# Altium schematic sheet [02] - STM32F1.SchDoc
size A3; DocumentNumber: 4; SheetNumber: 4; SheetTotal: 5
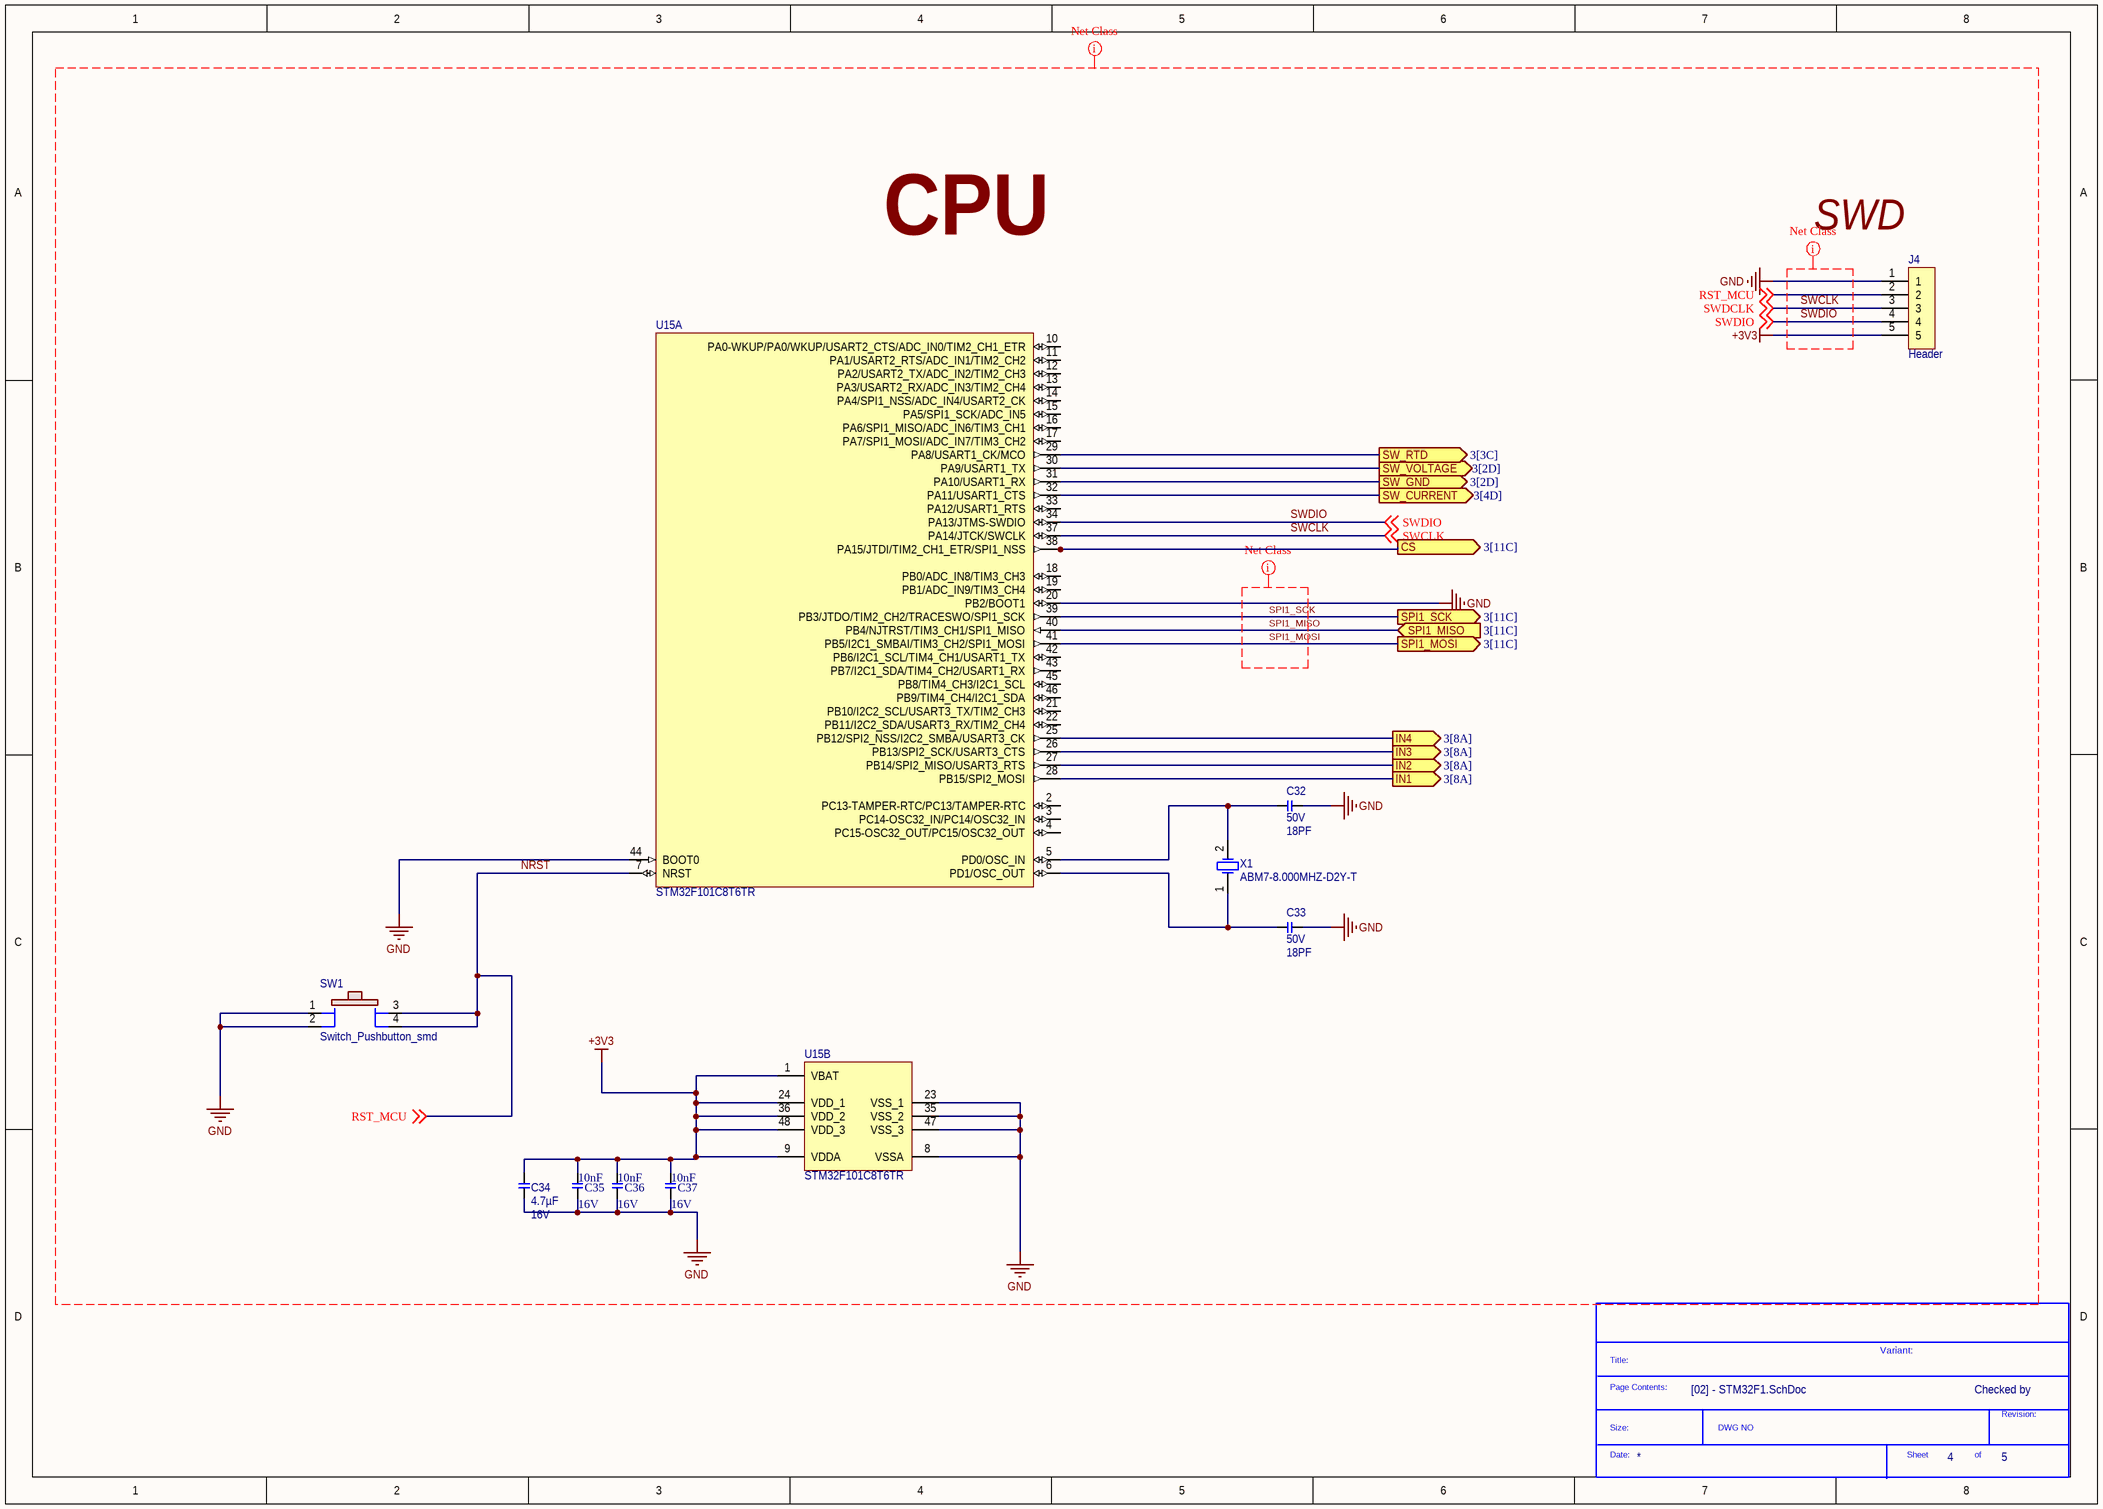
[diagram p0: [02] - STM32F1.SchDoc]

## Parts
*?  SDTitleBlock  (value not drawn)  (graphical)
C32  voltage_rating_dc: 50V  [C0805]  (hidden comment: 18PF)
C33  voltage_rating_dc: 50V  [C0805]  (hidden comment: 18PF)
C34  Voltage - Rated: 16V  [C0805]  (hidden comment: 4.7µF)
C35  Voltage - Rated: 16V  [C0805]  (hidden comment: 10nF)
C36  Voltage - Rated: 16V  [C0805]  (hidden comment: 10nF)
C37  Voltage - Rated: 16V  [C0805]  (hidden comment: 10nF)
J4  Header  [Header 1x5 2.54mm]  (no BOM)
SW1  Switch_Pushbutton_smd  [SW_B3SL-1022P]
U15  Manufacturer Part Number: STM32F101C8T6TR  [STM-LQFP48_M]  (hidden comment: IC-MC-STM32F101C8T6TR)  (parts A,B of 2)
X1  Manufacturer Part Number: ABM7-8.000MHZ-D2Y-T  [sm_osc_mixed]  (hidden comment: ABM7-8.000MHZ)

## Ports
CS (out, see 3[11C]), IN1 (out, see 3[8A]), IN2 (out, see 3[8A]), IN3 (out, see 3[8A]), IN4 (out, see 3[8A]), SPI1_MISO (in, see 3[11C]), SPI1_MOSI (out, see 3[11C]), SPI1_SCK (out, see 3[11C]), SW_CURRENT (out, see 3[4D]), SW_GND (out, see 3[2D]), SW_RTD (out, see 3[3C]), SW_VOLTAGE (out, see 3[2D])

## Nets
+3V3: C34.2 C35.2 C36.2 C37.2 J4.5 U15.1(VBAT) U15.9(VDDA) U15.24(VDD_1) U15.36(VDD_2) U15.48(VDD_3)
GND: C32.2 C33.2 C34.1 C35.1 C36.1 C37.1 J4.1 SW1.1 SW1.2 U15.8(VSSA) U15.20(PB2/BOOT1) U15.23(VSS_1) U15.35(VSS_2) U15.44(BOOT0) U15.47(VSS_3)
CS: U15.38(PA15/JTDI/TIM2_CH1_ETR/SPI1_NSS) ; port CS
IN1: U15.28(PB15/SPI2_MOSI) ; port IN1
IN2: U15.27(PB14/SPI2_MISO/USART3_RTS) ; port IN2
IN3: U15.26(PB13/SPI2_SCK/USART3_CTS) ; port IN3
IN4: U15.25(PB12/SPI2_NSS/I2C2_SMBA/USART3_CK) ; port IN4
NRST: J4.2 SW1.3 SW1.4 U15.7(NRST) ; off-sheet RST_MCU  [also labelled RST_MCU]
SPI1_MISO: U15.40(PB4/NJTRST/TIM3_CH1/SPI1_MISO) ; port SPI1_MISO
SPI1_MOSI: U15.41(PB5/I2C1_SMBAI/TIM3_CH2/SPI1_MOSI) ; port SPI1_MOSI
SPI1_SCK: U15.39(PB3/JTDO/TIM2_CH2/TRACESWO/SPI1_SCK) ; port SPI1_SCK
SW_CURRENT: U15.32(PA11/USART1_CTS) ; port SW_CURRENT
SW_GND: U15.31(PA10/USART1_RX) ; port SW_GND
SW_RTD: U15.29(PA8/USART1_CK/MCO) ; port SW_RTD
SW_VOLTAGE: U15.30(PA9/USART1_TX) ; port SW_VOLTAGE
SWCLK: J4.3 U15.37(PA14/JTCK/SWCLK) ; off-sheet SWCLK, off-sheet SWDCLK  [also labelled SWDCLK]
SWDIO: J4.4 U15.34(PA13/JTMS-SWDIO) ; off-sheet SWDIO
NetC32_1: C32.1 U15.5(PD0/OSC_IN) X1.2(OSC2)
NetC33_1: C33.1 U15.6(PD1/OSC_OUT) X1.1(OSC1)

Not connected (* = marked no-connect by the designer): U15 2(PC13-TAMPER-RTC/PC13/TAMPER-RTC) 3(PC14-OSC32_IN/PC14/OSC32_IN) 4(PC15-OSC32_OUT/PC15/OSC32_OUT) 10(PA0-WKUP/PA0/WKUP/USART2_CTS/ADC_IN0/TIM2_CH1_ETR) 11(PA1/USART2_RTS/ADC_IN1/TIM2_CH2) 12(PA2/USART2_TX/ADC_IN2/TIM2_CH3) 13(PA3/USART2_RX/ADC_IN3/TIM2_CH4) 14(PA4/SPI1_NSS/ADC_IN4/USART2_CK) 15(PA5/SPI1_SCK/ADC_IN5) 16(PA6/SPI1_MISO/ADC_IN6/TIM3_CH1) 17(PA7/SPI1_MOSI/ADC_IN7/TIM3_CH2) 18(PB0/ADC_IN8/TIM3_CH3) 19(PB1/ADC_IN9/TIM3_CH4) 21(PB10/I2C2_SCL/USART3_TX/TIM2_CH3) 22(PB11/I2C2_SDA/USART3_RX/TIM2_CH4) 33(PA12/USART1_RTS) 42(PB6/I2C1_SCL/TIM4_CH1/USART1_TX) 43(PB7/I2C1_SDA/TIM4_CH2/USART1_RX) 45(PB8/TIM4_CH3/I2C1_SCL) 46(PB9/TIM4_CH4/I2C1_SDA)

## Layout directives
net class SPI_1: SPI1_MISO, SPI1_MOSI, SPI1_SCK
net class SWD: SWCLK, SWDIO
net class CPU: +3V3, GND, NRST, RST_MCU, SPI1_MISO, SPI1_MOSI, SPI1_SCK, SWCLK, SWDCLK, SWDIO

## Notes on the sheet
- (near J4) SWD
- CPU
- Variant:
- Checked by
- (in symbol SDTitleBlock) Title:; Page Contents:; Revision:; Size:; DWG NO; Date:; Sheet; of

## Library data of the parts
C32 C33 = C-18PF,50V,0805: MULTICOMP - MC0805N180J500CT - CAP, MLCC, C0G/NP0, 18PF, 50V,0805, REEL; capacitance_tolerance: ±5%; pin_count: 2; Supplier 1: Octopart; Manufacturer: Multicomp; Manufacturer Part Number: MC0805N180J500CT; Stock 1: 3187; Pricing 1: 1=0.11400, 10=0.07300, 50=0.04100, 100=0.03200, 250=0.02600, 500=0.02200, 1000=0.01800 (USD); reach_svhc_compliance: No SVHC; rohs_status: Compliant; dielectric_characteristic: C0G/NP0; Octopart Url: http://octopart.com/mc0805n180j500ct-multicomp-10529169; Seller Landing  Url: https://octopart-clicks.com/click/track?country=TR&ak=8157f166&sig=03c9fd1&sid=2402&ppid=10529169&vpid=17760821&ct=offers; OctopartID: 811748bd0de05ed0; ComponentLink1URL: http://datasheet.octopart.com/MC0805N180J500CT-Multicomp-datasheet-16478625.pdf; ComponentLink1Description: http://datasheet.octopart.com/MC0805N180J500CT-Multicomp-datasheet-16478625.pdf; ComponentLink2URL: http://datasheet.octopart.com/MC0805N180J500CT-Multicomp-datasheet-22150886.pdf; ComponentLink2Description: http://datasheet.octopart.com/MC0805N180J500CT-Multicomp-datasheet-22150886.pdf; ComponentLink3URL: http://datasheet.octopart.com/MC0805N180J500CT-Multicomp-datasheet-8445804.pdf; ComponentLink3Description: http://datasheet.octopart.com/MC0805N180J500CT-Multicomp-datasheet-8445804.pdf; ComponentLink4URL: http://datasheet.octopart.com/MC0805N180J500CT-Multicomp-datasheet-34215986.pdf; ComponentLink4Description: http://datasheet.octopart.com/MC0805N180J500CT-Multicomp-datasheet-34215986.pdf; ComponentLink5URL: http://datasheet.octopart.com/MC0805N180J500CT-Multicomp-datasheet-26590290.pdf; ComponentLink5Description: http://datasheet.octopart.com/MC0805N180J500CT-Multicomp-datasheet-26590290.pdf; ComponentLink6URL: http://datasheet.octopart.com/MC0805N180J500CT-Multicomp-datasheet-15500401.pdf; ComponentLink6Description: http://datasheet.octopart.com/MC0805N180J500CT-Multicomp-datasheet-15500401.pdf; ComponentLink7URL: http://datasheet.octopart.com/MC0805N180J500CT-Multicomp-datasheet-10838970.pdf; ComponentLink7Description: http://datasheet.octopart.com/MC0805N180J500CT-Multicomp-datasheet-10838970.pdf; Supplier Part Number 1: Newark - 06R4039; capacitance: 18PF
C34 = C-4.7UF,16V,0805: AVX - 0805YC475KAT2A - CAP, MLCC, X7R, 4.7UF, 16V, 0805; Manufacturer: AVX Corporation; Tolerance: ±10%; Supplier 1: Digi-Key; Manufacturer Part Number: 0805YC475KAT2A; RoHS: RoHS Compliant; Category: Capacitors; Stock 1: 16611; Pricing 1: 1=0.78, 10=0.578, 25=0.4952, 50=0.462, 100=0.396, 250=0.363, 500=0.3135, 1000=0.264 (USD); Packaging: Cut Tape (CT); Temperature Coefficient: X7R; Mounting Type: Surface Mount, MLCC; Operating Temperature: -55°C ~ 125°C; Applications: General Purpose; Ratings: -; Package / Case: 0805 (2012 Metric); Size / Dimension: 0.079" L x 0.049" W (2.01mm x 1.25mm); Height - Seated (Max): -; Thickness (Max): 0.060" (1.52mm); Lead Spacing: -; Features: -; Lead Style: -; ComponentLink1URL: http://datasheets.avx.com/X7RDielectric.pdf; ComponentLink1Description: http://datasheets.avx.com/X7RDielectric.pdf; Supplier Part Number 1: 478-5722-1-ND; Capacitance: 4.7µF
C35-C37 = C-10NF,0805: CAP CER 10000PF 16V NP0 0805; Manufacturer: AVX Corporation; Manufacturer Part Number: 0805YA103JAT2A; Tolerance: ±5%; Temperature Coefficient: C0G, NP0; Supplier 1: Digi-Key; RoHS: RoHS Compliant; Category: Capacitors; Stock 1: 28062; Pricing 1: 1=0.29, 10=0.204, 25=0.1668, 50=0.1424, 100=0.1221, 250=0.10176, 500=0.09158, 1000=0.07733 (USD); Packaging: Cut Tape (CT); Mounting Type: Surface Mount, MLCC; Operating Temperature: -55°C ~ 125°C; Applications: General Purpose; Ratings: -; Package / Case: 0805 (2012 Metric); Size / Dimension: 0.079" L x 0.049" W (2.01mm x 1.25mm); Height - Seated (Max): -; Thickness (Max): 0.037" (0.94mm); Lead Spacing: -; Features: -; Lead Style: -; ComponentLink1URL: http://datasheets.avx.com/C0GNP0-Dielectric.pdf; ComponentLink1Description: http://datasheets.avx.com/C0GNP0-Dielectric.pdf; Supplier Part Number 1: 478-1334-1-ND; Capacitance: 10nF
J4 = CON-Header 1X5 2.54MM: Header 1X5 2.54
SW1 = Switch_Pushbutton_smd: Switch Push Button tactile; TIIntPartnumber: 2W0018; MfrNum: B3SL-1022P; Mfr: Omron; PartName: SwitchPushMomTactilesmd; Cost10K: 0.25; Cost100: 0.340; Vendor: Digikey; DescriptiveText: Switch Push Button tactile; Descriptive_Text: Switch Push Button tactile
U15 = IC-MC-STM32F101C8T6TR: IC MCU 32BIT 64KB FLASH 48LQFP; Manufacturer: STMicroelectronics; Core Processor: ARM® Cortex®-M3; Core Size: 32-Bit; Speed: 36MHz; Connectivity: I²C, IrDA, LIN, SPI, UART/USART; Peripherals: DMA, PDR, POR, PVD, PWM, Temp Sensor, WDT; Number of I/O: 37; Program Memory Size: 64KB (64K x 8); RAM Size: 10K x 8; Voltage - Supply (Vcc/Vdd): 2 V ~ 3.6 V; Data Converters: A/D 10x12b; Oscillator Type: Internal; Supplier 1: Digi-Key; RoHS: RoHS Compliant; Category: Integrated Circuits (ICs); Stock 1: 0; Pricing 1: 2400=2.46449 (USD); Packaging: Tape & Reel (TR); Program Memory Type: FLASH; EEPROM Size: -; Operating Temperature: -40°C ~ 85°C (TA); Package / Case: 48-LQFP; Supplier Device Package: 48-LQFP (7x7); ComponentLink1URL: http://www.st.com/content/ccc/resource/technical/document/datasheet/6b/28/4e/ce/a7/d3/42/8d/CD00161561.pdf/files/CD00161561.pdf/jcr:content/translations/en.CD00161561.pdf; ComponentLink1Description: http://www.st.com/content/ccc/resource/technical/document/datasheet/6b/28/4e/ce/a7/d3/42/8d/CD00161561.pdf/files/CD00161561.pdf/jcr:content/translations/en.CD00161561.pdf; Supplier Part Number 1: STM32F101C8T6TR-ND
X1 = OSC-ABM7-8.000MHZ-D2Y-T: CRYSTAL 8.0000MHZ 18PF SMD; Manufacturer: Abracon LLC; Frequency: 8MHz; Frequency Stability: ±30ppm; Frequency Tolerance: ±20ppm; ESR (Equivalent Series Resistance): 100 Ohm; Operating Mode: Fundamental; Supplier 1: Digi-Key; RoHS: RoHS Compliant; Category: Crystals and Oscillators; Stock 1: 111842; Pricing 1: 1=0.76, 10=0.678, 50=0.6328, 100=0.56, 500=0.5292 (USD); Packaging: Cut Tape (CT); Type: MHz Crystal; Load Capacitance: 18pF; Operating Temperature: -40°C ~ 85°C; Ratings: -; Mounting Type: Surface Mount; Package / Case: 2-SMD, No Lead (DFN, LCC); Size / Dimension: 0.236" L x 0.138" W (6.00mm x 3.50mm); Height: 0.055" (1.40mm); ComponentLink1URL: http://www.abracon.com/Resonators/abm7.pdf; ComponentLink1Description: http://www.abracon.com/Resonators/abm7.pdf; Supplier Part Number 1: 535-9831-1-ND